# EAGLE design Distance_V1.0 (EAGLE 9.4.1)
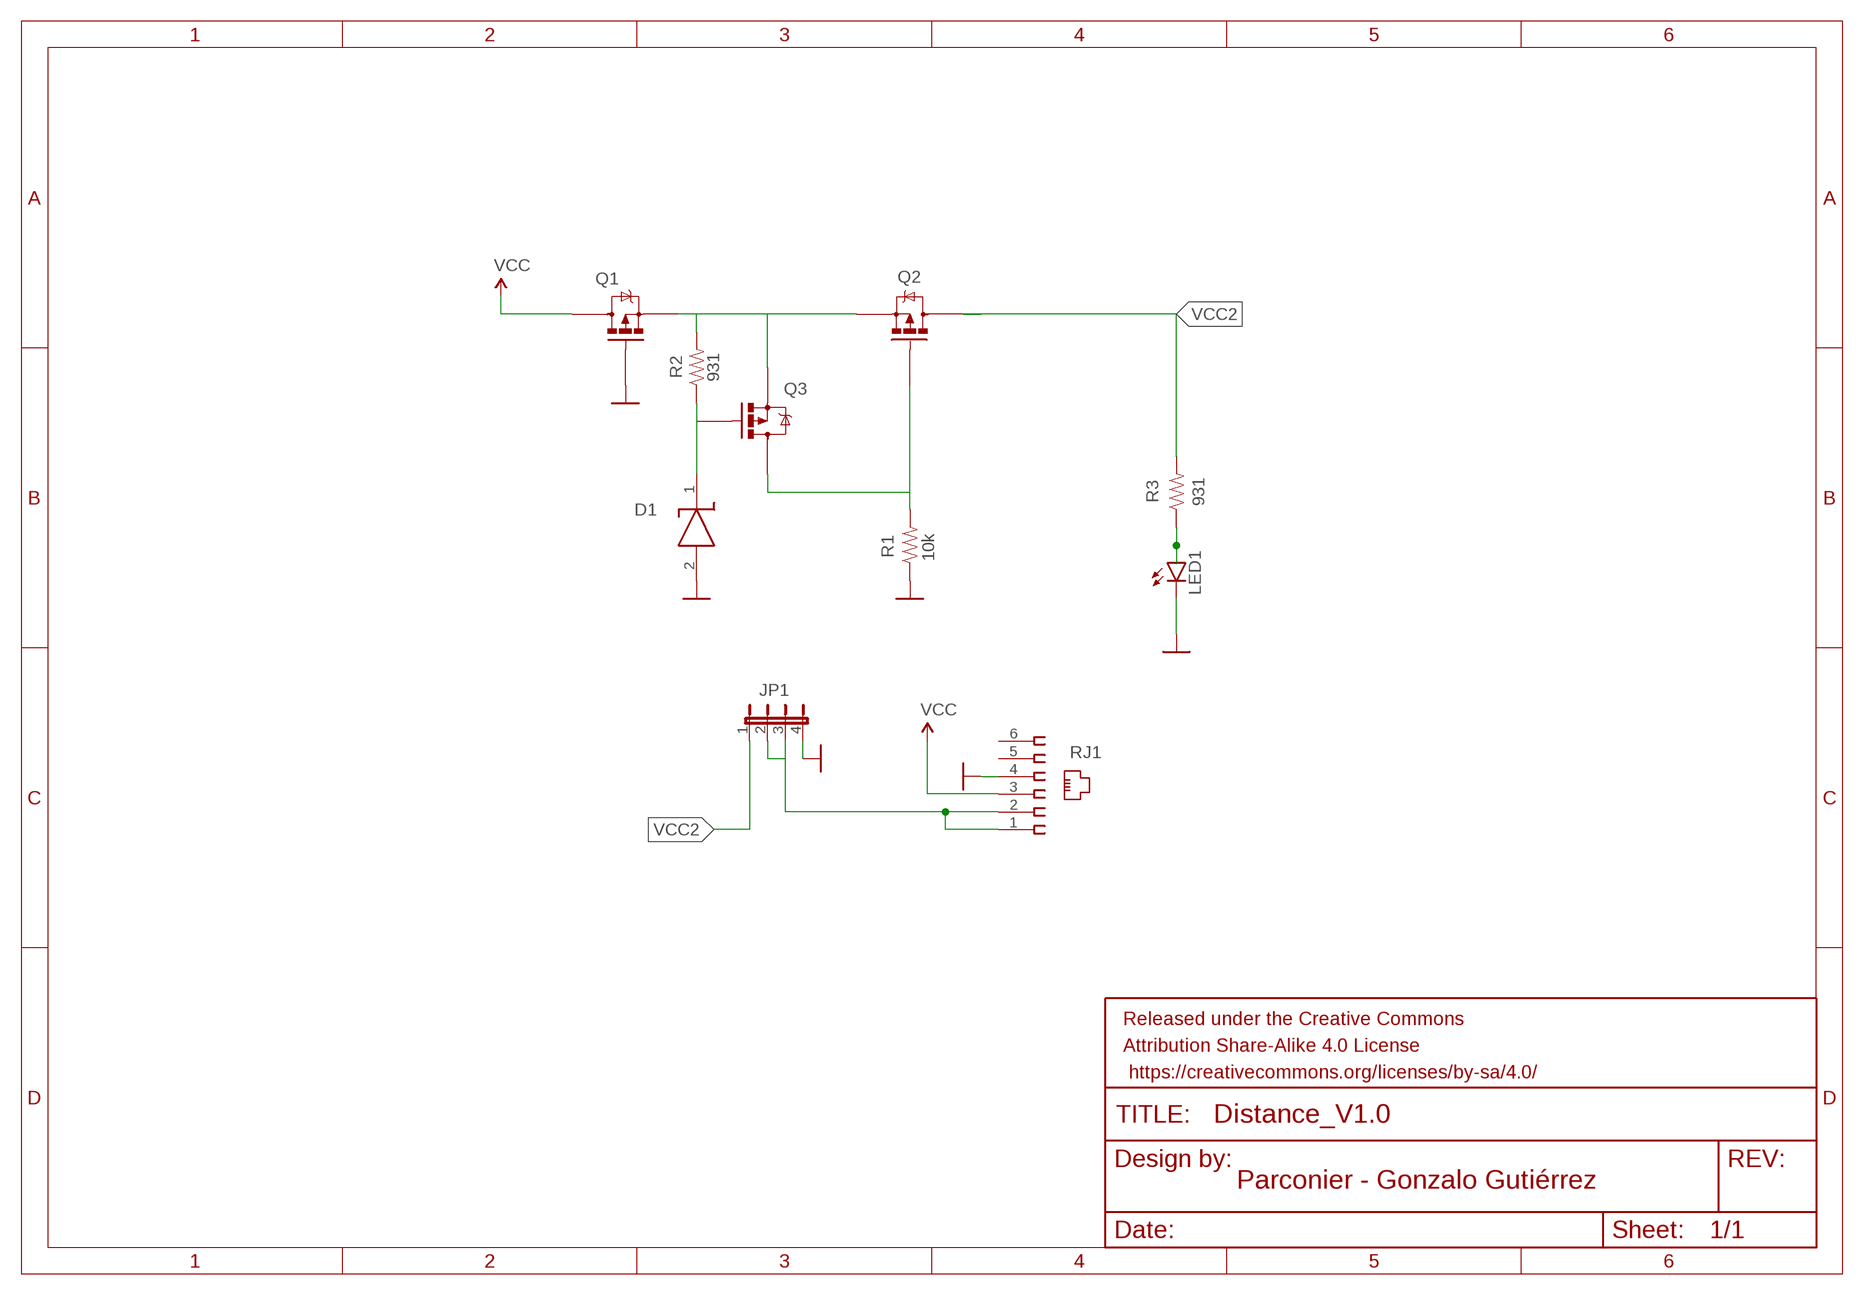
[diagram p0: schematic, sheet 1]

## Parts
D1  BZT52C5V1-7-F  [SOD3716X145N]
JP1  JP4E  [JP4]
LED1  LED0603  [LED-0603]
Q1  RU1C002ZPTCL  [SOTFL65P210X105-3N]
Q2  RU1C002ZPTCL  [SOTFL65P210X105-3N]
Q3  RU1C002ZPTCL  [SOTFL65P210X105-3N]
R1  10k  RES_0402  [RESC1005X35]
R2  931  RES_0402  [RESC1005X35]
R3  931  RES_0402  [RESC1005X35]
RJ1  615006138421  [615006138421]

## Nets
GND: D1.2(A) JP1.4 LED1.C Q1.1(G) R1.1 RJ1.4
N$1: Q1.2(S) Q2.2(S) Q3.2(S) R2.2
N$2: Q2.1(G) Q3.3(D) R1.2
N$3: D1.1(K) Q3.1(G) R2.1
N$4: JP1.2 JP1.3 RJ1.1 RJ1.2
N$9: LED1.A R3.1
VCC: Q1.3(D) RJ1.3
VCC2: JP1.1 Q2.3(D) R3.2
Unconnected: RJ1.5 RJ1.6

## Library data of the parts
D1 = BZT52C5V1-7-F:BZT52C5V1-7-F: Zener Diode 5.1V 5.8% 500mW SOD123 Diodes Inc BZT52C5V1-7-F Zener Diode, 5.1V 6% 0.5 W SMT 2-Pin SOD-123 Source: Datasheet <https://componentsearchengine.com/Datasheets/2/BZT52C5V1-7-F.pdf>; ALLIED_NUMBER: 71028127; ALLIED_PRICE/STOCK: https://www.alliedelec.com/diodes-inc-bzt52c5v1-7-f/71028127/; ARROW_PART_NUMBER: BZT52C5V1-7-F; ARROW_PRICE/STOCK: https://www.arrow.com/en/products/bzt52c5v1-7-f/diodes-incorporated; DESCRIPTION: Zener Diode 5.1V 5.8% 500mW SOD123 Diodes Inc BZT52C5V1-7-F Zener Diode, 5.1V 6% 0.5 W SMT 2-Pin SOD-123; HEIGHT: 1.45mm; MANUFACTURER_NAME: Diodes Inc.; MANUFACTURER_PART_NUMBER: BZT52C5V1-7-F; MPN: BZT52C5V1-7-F; RS_PART_NUMBER: 7384951P; RS_PRICE/STOCK: http://uk.rs-online.com/web/p/products/7384951P
JP1 = Ultrasonic_Sensor:JP4E; MPN: HC-SR04
LED1 = SparkFun-LED:LED: LEDs Standard schematic elements and footprints for 5mm, 3mm, 1206, and 0603 sized LEDs. 5mm - Spark Fun Electronics SKU : COM-00529 (and others); MPN: LTST-C193KRKT-5A
Q1-Q3 = RU1C002ZPTCL:RU1C002ZPTCL: ROHM - RU1C002ZPTCL - MOSFET, P-CH, -20V, -0.2A, SOT-323FL Source: Datasheet <https://componentsearchengine.com/Datasheets/2/RU1C002ZPTCL.pdf>; ARROW_PART_NUMBER: RU1C002ZPTCL; DESCRIPTION: ROHM - RU1C002ZPTCL - MOSFET, P-CH, -20V, -0.2A, SOT-323FL; HEIGHT: 1.05mm; MANUFACTURER_NAME: ROHM Semiconductor; MANUFACTURER_PART_NUMBER: RU1C002ZPTCL; MPN: RU1C002ZPTCL
R1 = Perfect_0402:RES_0402; MPN: RC0402JR-7W10KL
R2 R3 = Perfect_0402:RES_0402; MPN: RC0402FR-07931RL
RJ1 = 615006138421:615006138421: HORIZONTAL PLASTIC 6P6C MODULAR JACK TAP UP Source: Datasheet <http://docs-europe.electrocomponents.com/webdocs/0f88/0900766b80f88670.pdf>; DESCRIPTION: HORIZONTAL PLASTIC 6P6C MODULAR JACK TAP UP; HEIGHT: mm; MANUFACTURER_NAME: W&uuml;rth Elektronik; MANUFACTURER_PART_NUMBER: 615006138421; MPN: 54601-906WPLF; RS_PART_NUMBER: 7350282; SUPPLIER_NAME: RS

## Board
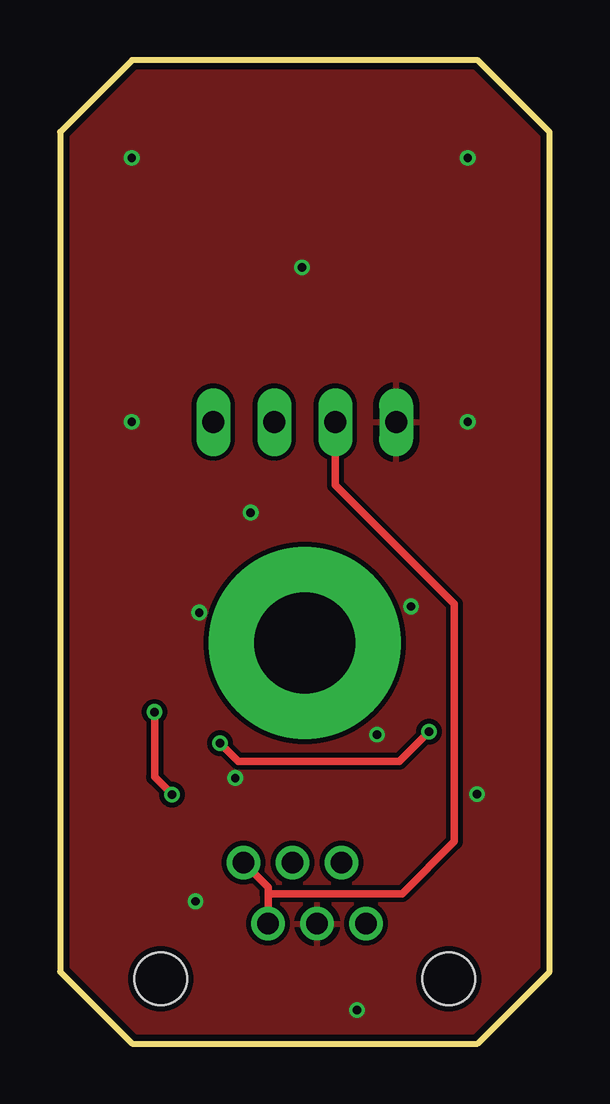
[diagram p1: board, top side]
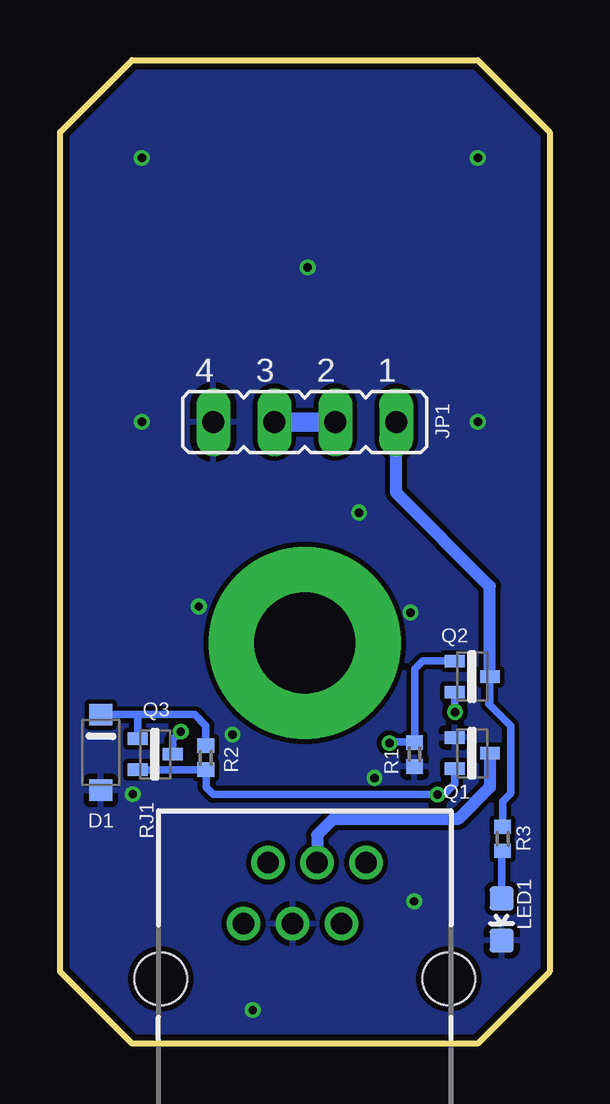
[diagram p2: board, bottom side, seen from below]

Size 20.4 x 41 mm. Coordinates in mm from the lower left corner, seen from the top.
Outline: 3,41 0,38 0,3 3,0 17.4,0 20.4,3 20.4,38 17.4,41 3,41
Copper layers (1*16): Top 0.035mm / dielectric 1.5mm / Bottom 0.035mm
Design rules "SeeedStudio_2layer_DRU_no_angle_20140221": minimum track width 6mil, minimum drill 12mil, track to track 6mil, track to pad 6mil, pad to pad 6mil, via to via 6mil, smd to smd 0mil, copper to edge 10mil, drill to drill 10mil, minimum pad ring 10mil, minimum via ring 6mil, stop-mask expansion 2mil, vias tented up to drill 100mil, thermal gap 10mil

### Footprints (pad centres in the part's own frame; a part is rotated, then mirrored left to right if it is on the bottom)
SOD3716X145N = smd 0.9 x 0.95: 1 -1.575,0; 2 1.575,0
JP4 = drill 0.914 long: 1 -3.81,0; 2 -1.27,0; 3 1.27,0; 4 3.81,0
LED-0603 = smd 1 x 1: A 0,-0.877; C 0,0.877
SOTFL65P210X105-3N = smd 0.83 x 0.52: 1 -0.735,0.65; 2 -0.735,-0.65; 3 0.735,0
RESC1005X35 = smd 0.6 x 0.7: 1 -0.5,0; 2 0.5,0
615006138421 = drill 0.9 pad 1.4: 1 2.55,4.84; 2 1.53,2.3; 3 0.51,4.84; 4 -0.51,2.3; 5 -1.53,4.84; 6 -2.55,2.3 | hole 2.2: -6,0; 6,0

### Placement (x,y rotation side)
D1  18.7,12.13 270 bottom
JP1  10.2,25.9 180 bottom
LED1  2,5.17 180 bottom
Q1  3.22,12.1 0 bottom
Q2  3.22,15.29 0 bottom
Q3  16.43,12.06 0 bottom
R1  5.63,12.05 90 bottom
R2  14.33,11.91 270 bottom
R3  1.96,8.53 90 bottom
RJ1  10.2,2.7 0 bottom

### Tracks (layer width: path | path; a pad name or v marks a point on that pad's centre or on a via)
GND  (via drill 0.35)
  other vias: 2.99,25.92 2.99,36.92 16.99,36.92 16.99,25.92 7.3,11.07 13.21,12.88 14.62,18.22 7.95,22.13 5.8,17.96 17.37,10.39 12.37,1.39 5.64,5.93 10.08,32.35
  pour Top (isolate 0.2): 20.4,41 0,41 0,0 20.4,0
  pour Bottom (isolate 0.2): 0,41 20.4,41 20.4,0 0,0
N$1  (via drill 0.35)
  Top 0.305: v3.94,13.82 3.94,11.11 v4.67,10.38
  Bottom 0.305: Q2.2 3.95,13.83 v3.94,13.82 | Q1.2 3.95,10.83 4.4,10.38 v4.67,10.38 14.01,10.38 14.31,10.68 14.31,11.4 R2.2 Q3.2
N$2  (via drill 0.35)
  Top 0.305: v15.37,13 14.14,11.77 7.42,11.77 v6.67,12.52
  Bottom 0.305: Q2.1 5.29,15.94 5.61,15.62 5.61,12.57 | 5.61,12.57 R1.2 | Q3.3 15.69,12.68 v15.37,13 | v6.67,12.52 6.62,12.57 5.61,12.57
N$3
  Bottom 0.305: R2.1 14.33,13.25 14.79,13.71 17.19,13.71 | D1.1 17.19,13.71 | Q3.1 17.16,13.68 17.19,13.71
N$4
  Top 0.305: JP1.3 11.47,23.28 16.43,18.32 16.43,8.42 14.26,6.25 8.69,6.25 8.67,6.23 | RJ1.1 8.67,6.52 8.67,6.23 | 8.67,6.23 RJ1.2
  Bottom 0.813: JP1.3 JP1.2
N$6  (via drill 4.2 pad 8)
  other vias: 10.2,16.7
N$9
  Bottom 0.305: R3.1 2,7.99 LED1.A
VCC
  Bottom 0.508: RJ1.3 9.69,8.69 9.03,9.35 3.83,9.35 2.48,10.7 Q1.3
VCC2
  Bottom 0.305: R3.2 1.96,10.09 1.62,10.43 1.62,13.24 2.53,14.15 2.48,14.2 Q2.3
  Bottom 0.508: Q2.3 2.48,19.05 6.4,22.97 JP1.1